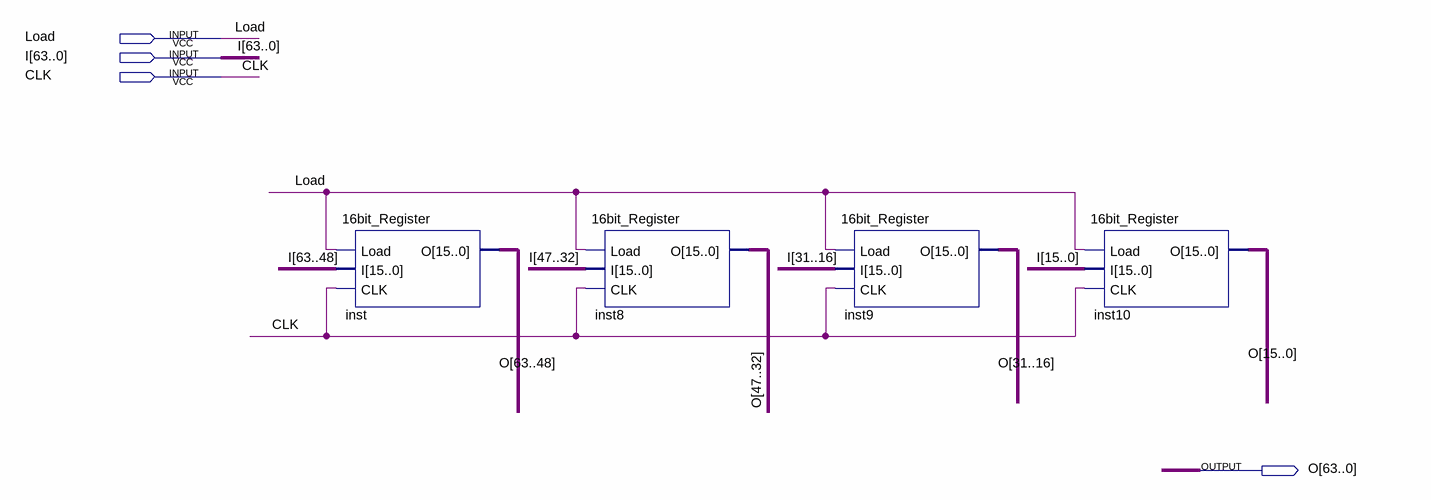
[diagram p0: schematic sheet]
// Quartus schematic 64bit_Register.bdf as structural Verilog: 4 symbols, 4 pins
module \64bit_Register  (
  input  Load,
  input  [63:0] I,
  input  CLK,
  output [63:0] O
);

  \16bit_Register  inst (.Load(Load), .I(I[63:48]), .CLK(CLK), .O(O[63:48]));
  \16bit_Register  inst8 (.Load(Load), .I(I[47:32]), .CLK(CLK), .O(O[47:32]));
  \16bit_Register  inst9 (.Load(Load), .I(I[31:16]), .CLK(CLK), .O(O[31:16]));
  \16bit_Register  inst10 (.Load(Load), .I(I[15:0]), .CLK(CLK), .O(O[15:0]));
endmodule
